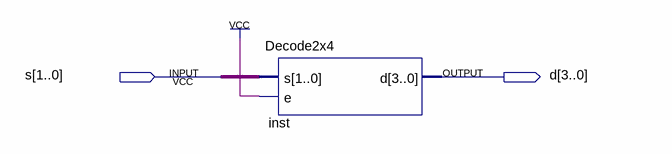
[diagram p0: schematic sheet]
// Quartus schematic test1.bdf as structural Verilog: 1 symbols, 2 pins
module test1 (
  input  [1:0] s,
  output [3:0] d
);

  Decode2x4 inst (.s(s), .e(1'b1), .d(d));
endmodule
